# Altium schematic sheet main.SchDoc
size A4
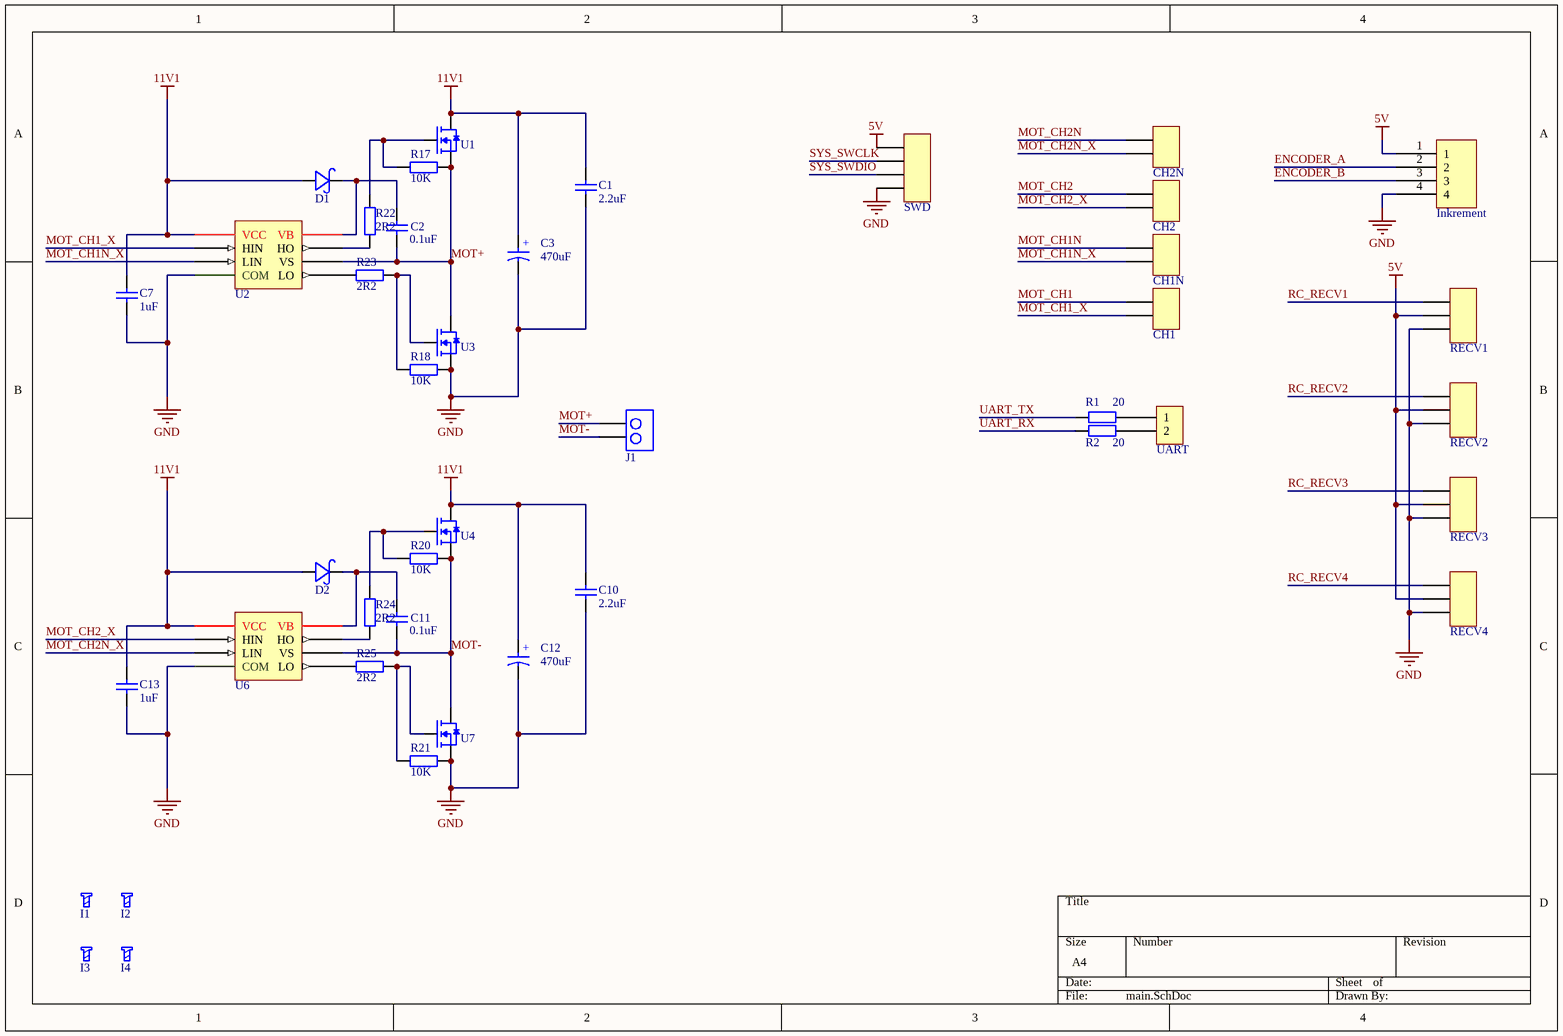
[diagram p0: main.SchDoc]

## Parts
C1  Capacitance: 2.2uF  [10mm lead spacing CAP]  (hidden comment: R60DF4220506AJ)
C2  Capacitance: 0.1uF  [0805]  (hidden comment: VJ0805Y104JXATW1BC)
C3  Capacitance: 470uF  [5mm lead spacing ELCAP]  (hidden comment: EEU-FR1V471)
C7  Capacitance: 1uF  [0805]  (hidden comment: VJ0805Y105KXQTW1BC)
C10  Capacitance: 2.2uF  [10mm lead spacing CAP]  (hidden comment: R60DF4220506AJ)
C11  Capacitance: 0.1uF  [0805]  (hidden comment: VJ0805Y104JXATW1BC)
C12  Capacitance: 470uF  [5mm lead spacing ELCAP]  (hidden comment: EEU-FR1V471)
C13  Capacitance: 1uF  [0805]  (hidden comment: VJ0805Y105KXQTW1BC)
CH1  2-Pin Header  [2-Pin Header]  (value not drawn)
CH1N  2-Pin Header  [2-Pin Header]  (value not drawn)
CH2  2-Pin Header  [2-Pin Header]  (value not drawn)
CH2N  2-Pin Header  [2-Pin Header]  (value not drawn)
D1  SS32A  [DO-214AC(SMA)]  (value not drawn)
D2  SS32A  [DO-214AC(SMA)]  (value not drawn)
I1  M3 screw drillhole  [3mm diameter drill]  (value not drawn)
I2  M3 screw drillhole  [3mm diameter drill]  (value not drawn)
I3  M3 screw drillhole  [3mm diameter drill]  (value not drawn)
I4  M3 screw drillhole  [3mm diameter drill]  (value not drawn)
Inkrement  43-17-42  [43-17-42]  (value not drawn)
J1  1935776  [PT 2,5/ 2-5,0-H]  (value not drawn)
R1  Resistance: 20  [0805]  (hidden comment: CR0805-FX-20R0ELF)
R2  Resistance: 20  [0805]  (hidden comment: CR0805-FX-20R0ELF)
R17  10K  [FP_0805_RES]
R18  10K  [FP_0805_RES]
R20  10K  [FP_0805_RES]
R21  10K  [FP_0805_RES]
R22  2R2  [FP_0805_RES]
R23  2R2  [FP_0805_RES]
R24  2R2  [FP_0805_RES]
R25  2R2  [FP_0805_RES]
RECV1  3-Pin HEADER  [3-Pin HEADER]  (value not drawn)
RECV2  3-Pin HEADER  [3-Pin HEADER]  (value not drawn)
RECV3  3-Pin HEADER  [3-Pin HEADER]  (value not drawn)
RECV4  3-Pin HEADER  [3-Pin HEADER]  (value not drawn)
SWD  4-Pin Header  [4-Pin Header]  (value not drawn)
U1  IRLR8743TRLPBF  [TO-252 (DPAK)]  (value not drawn)
U2  IRS2186STRPBF  [8-Pin SOIC]  (value not drawn)
U3  IRLR8743TRLPBF  [TO-252 (DPAK)]  (value not drawn)
U4  IRLR8743TRLPBF  [TO-252 (DPAK)]  (value not drawn)
U6  IRS2186STRPBF  [8-Pin SOIC]  (value not drawn)
U7  IRLR8743TRLPBF  [TO-252 (DPAK)]  (value not drawn)
UART  2-Pin HEADER  [2-Pin Header]  (value not drawn)

## Nets
5V: Inkrement.1 RECV1.2 RECV2.2 RECV3.2 RECV4.2 SWD.1
11V1: C1.2 C3.1 C7.2 C10.2 C12.1 C13.2 D1.A D2.A U1.D U2.5(VCC) U4.D U6.5(VCC)
GND: C1.1 C3.2 C7.1 C10.1 C12.2 C13.1 Inkrement.4 R18.2 R21.2 RECV1.3 RECV2.3 RECV3.3 RECV4.3 SWD.4 U2.3(COM) U3.S U6.3(COM) U7.S
ENCODER_A: Inkrement.2
ENCODER_B: Inkrement.3
MOT+: C2.1 J1.1 R17.2 U1.S U2.6(VS) U3.D
MOT-: C11.1 J1.2 R20.2 U4.S U6.6(VS) U7.D
MOT_CH1: CH1.1
MOT_CH1_X: CH1.2 U2.1(HIN)
MOT_CH1N: CH1N.1
MOT_CH1N_X: CH1N.2 U2.2(LIN)
MOT_CH2: CH2.1
MOT_CH2_X: CH2.2 U6.1(HIN)
MOT_CH2N: CH2N.1
MOT_CH2N_X: CH2N.2 U6.2(LIN)
RC_RECV1: RECV1.1
RC_RECV2: RECV2.1
RC_RECV3: RECV3.1
RC_RECV4: RECV4.1
SYS_SWCLK: SWD.2
SYS_SWDIO: SWD.3
UART_RX: R2.1
UART_TX: R1.1
NetC2_2: C2.2 D1.K U2.8(VB)
NetC11_2: C11.2 D2.K U6.8(VB)
NetR1_2: R1.2 UART.1
NetR2_2: R2.2 UART.2
NetR17_1: R17.1 R22.2 U1.G
NetR18_1: R18.1 R23.1 U3.G
NetR20_1: R20.1 R24.2 U4.G
NetR21_1: R21.1 R25.1 U7.G
NetR22_1: R22.1 U2.7(HO)
NetR23_2: R23.2 U2.4(LO)
NetR24_1: R24.1 U6.7(HO)
NetR25_2: R25.2 U6.4(LO)

## Notes on the sheet
- (in symbol EEU-FR1V471) +

## Library data of the parts
C1 C10 = R60DF4220506AJ: General Purpose Metallized Polyester Film Capacitor, 2.2 uF, 40 VAC, 63 VDC , 5 %
C2 C11 = VJ0805Y104JXATW1BC: SMD Multilayer Ceramic Capacitor, 0805 [2012 Metric], 0.1 µF, 50 V, ± 5%, X7R, VJ Series
C3 C12 = EEU-FR1V471: Aluminum Electrolytic Capacitors, 470uF, Low ESR
C7 C13 = VJ0805Y105KXQTW1BC: SMD Multilayer Ceramic Capacitor, 0805 [2012 Metric], 1 µF, 10 V, ± 10%, X7R, VJ Series
CH1 CH1N CH2 CH2N = 2-Pin Header: TÜSKESOR 2 P SMD SPHSS220-B02-4/3 (T-T) 2mm PIN 0.5x0.5 TÖRDELHETÖ [ 43-10-37 ]
D1 D2 = SS32A: 3A 40V DO-214AC SCH.RECT. SS34A (YET) SMA (SK34A;SX34) [ 83-02-56 ]
I1-I4 = M3 screw drillhole: 5mm diameter via with 3mm hole
Inkrement = 43-17-42: TÁPCSATL. 2.00mm 4P APA 90° NCW200S-04R (G-S) FORR. [ 43-17-42 ]
J1 = 1935776: PCB terminal block, nominal current: 32 A, nom. voltage: 400 V, pitch: 5 mm, number of positions: 2
R1 R2 = CR0805-FX-20R0ELF: Thick Film Resistors - SMD 20ohm 1%
R17 R18 R20 R21 = RES 10K: Resistor; Tolerance: 5%; Power: 125mW; Name: YAGEO (PHYCOMP)  RC0805JR-0710KL  SMD Chip Resistor, Thick Film, 10 kohm; Reference: 9234136; Supplier: Farnell; Value: 10K
R22 = RES 2R2: Resistor; Tolerance: 5%; Reference: 2671001; Power: 125mW; Supplier: Farnell; Value: 2R2
R23-R25 = RES 2R2: Resistor; Tolerance: 5%; Power: 125mW; Reference: 2671001; Supplier: Farnell; Value: 2R2
U1 U3 U4 U7 = IRLR8743TRLPBF: HEXFET2Power MOSFET, Vdss=30V, Rdson=3.1mOhm, Qg=39nC, Id=160A
U2 U6 = IRS2186STRPBF: High and Low Side Driver